# EAGLE design ab-berry (EAGLE 7.3.0)
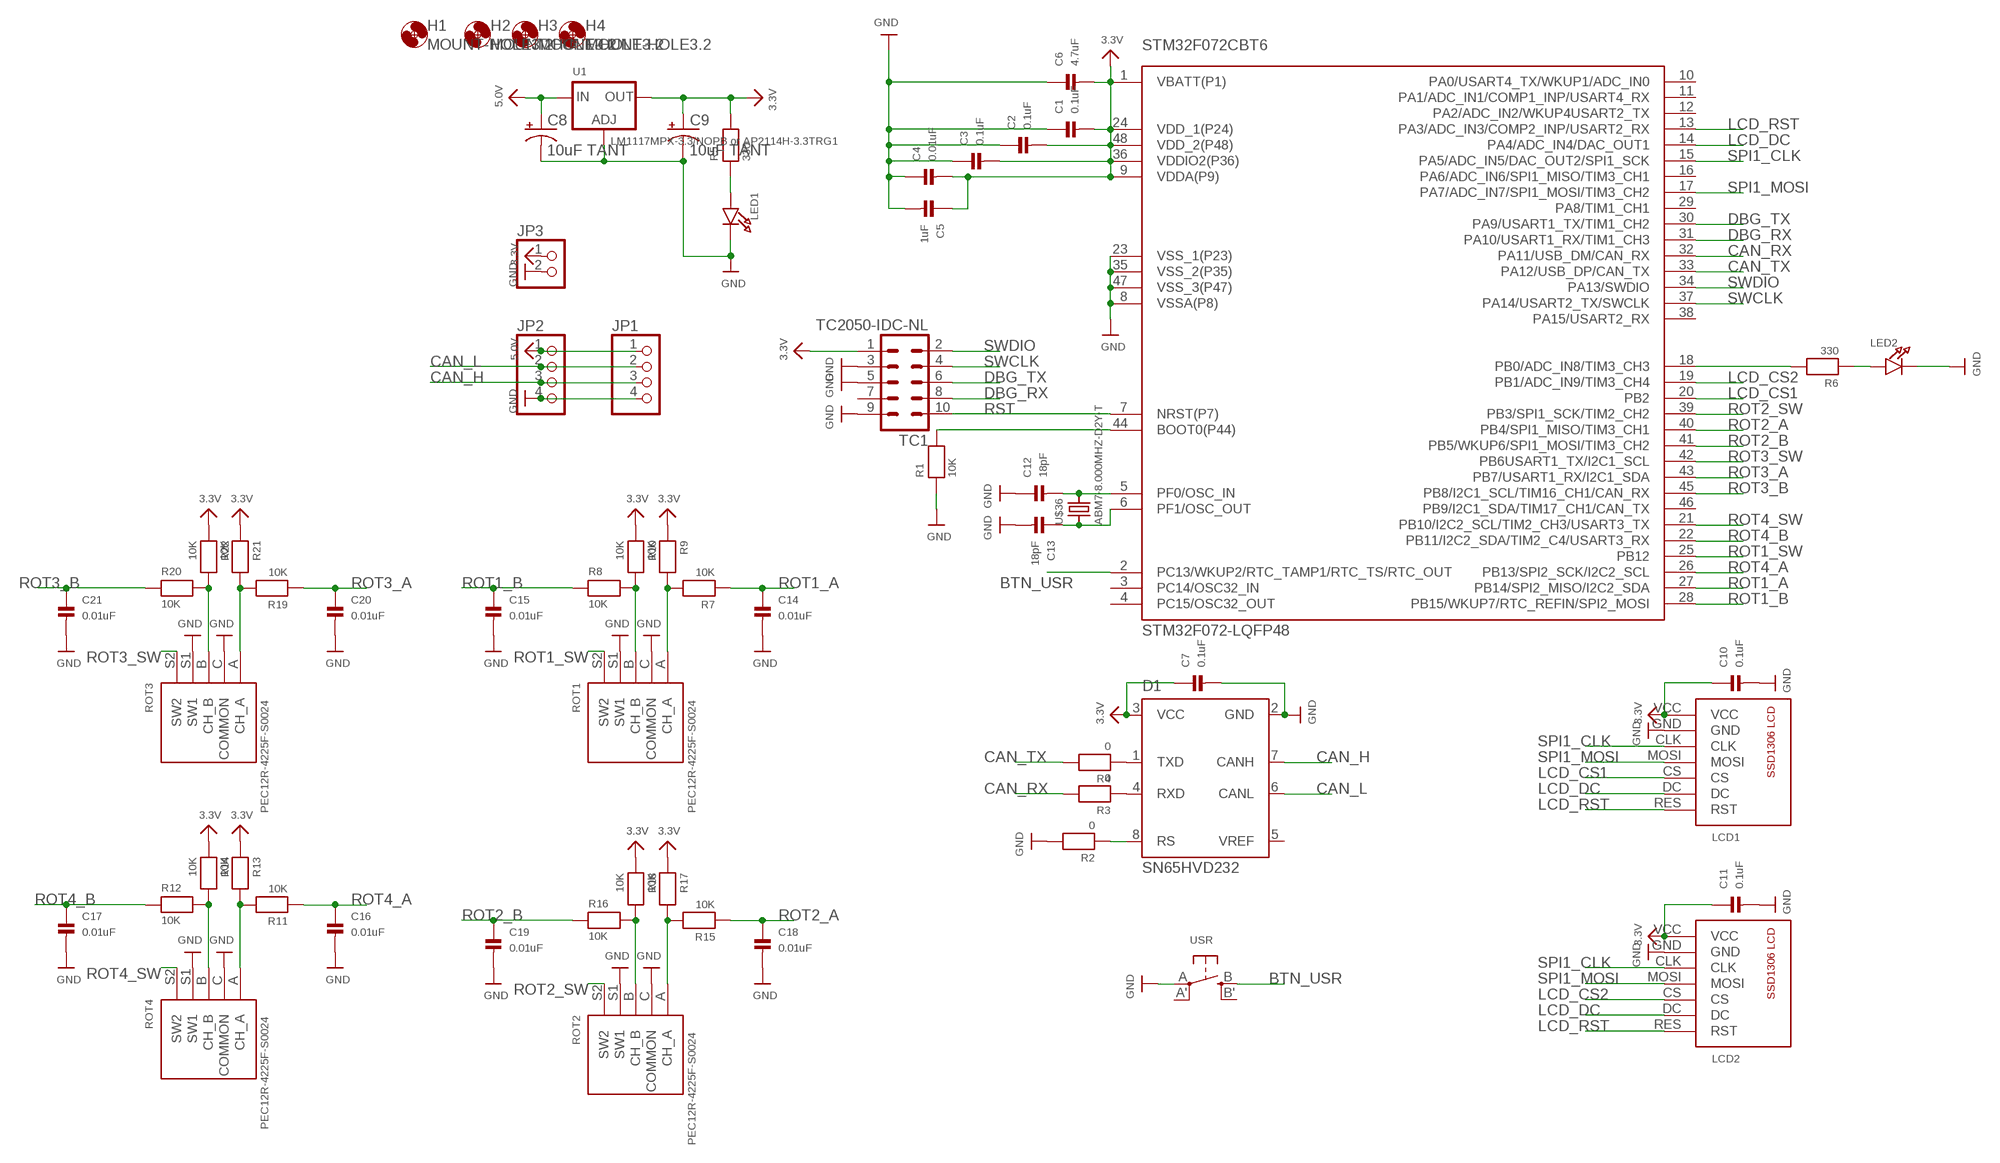
[diagram p0: schematic, sheet 1]

## Parts
C1  0.1uF  CAP_CERAMIC0603  [0603]
C2  0.1uF  CAP_CERAMIC0603  [0603]
C3  0.1uF  CAP_CERAMIC0603  [0603]
C4  0.01uF  CAP_CERAMIC0603  [0603]
C5  1uF  CAP_CERAMIC0603  [0603]
C6  4.7uF  CAP_CERAMIC0603  [0603]
C7  0.1uF  CAP_CERAMIC0603  [0603]
C8  10uF TANT  10UF-6.3V-20%(0603)(TANT)"  [0603-POL]
C9  10uF TANT  10UF-6.3V-20%(0603)(TANT)"  [0603-POL]
C10  0.1uF  CAP_CERAMIC0603  [0603]
C11  0.1uF  CAP_CERAMIC0603  [0603]
C12  18pF  CAP_CERAMIC0603  [0603]
C13  18pF  CAP_CERAMIC0603  [0603]
C14  0.01uF  CAP_CERAMIC0603  [0603]
C15  0.01uF  CAP_CERAMIC0603  [0603]
C16  0.01uF  CAP_CERAMIC0603  [0603]
C17  0.01uF  CAP_CERAMIC0603  [0603]
C18  0.01uF  CAP_CERAMIC0603  [0603]
C19  0.01uF  CAP_CERAMIC0603  [0603]
C20  0.01uF  CAP_CERAMIC0603  [0603]
C21  0.01uF  CAP_CERAMIC0603  [0603]
D1  SN65HVD232  SN65HVD230  [SO8]
H1  MOUNT-HOLE3.2  [3,2]
H2  MOUNT-HOLE3.2  [3,2]
H3  MOUNT-HOLE3.2  [3,2]
H4  MOUNT-HOLE3.2  [3,2]
JP1  PINHD-1X4  [1X04]
JP2  PINHD-1X4  [1X04]
JP3  PINHD-1X2  [1X02]
LCD1  SSD1306-7PIN  [SSD1306-7PIN]
LCD2  SSD1306-7PIN  [SSD1306-7PIN]
LED1  LED0603  [CHIPLED_0603]
LED2  LED0603  [CHIPLED_0603]
R1  10K  RESISTOR0603  [0603]
R2  0  RESISTOR0603  [0603]
R3  0  RESISTOR0603  [0603]
R4  0  RESISTOR0603  [0603]
R5  330  RESISTOR0603  [0603]
R6  330  RESISTOR0603  [0603]
R7  10K  RESISTOR0603  [0603]
R8  10K  RESISTOR0603  [0603]
R9  10K  RESISTOR0603  [0603]
R10  10K  RESISTOR0603  [0603]
R11  10K  RESISTOR0603  [0603]
R12  10K  RESISTOR0603  [0603]
R13  10K  RESISTOR0603  [0603]
R14  10K  RESISTOR0603  [0603]
R15  10K  RESISTOR0603  [0603]
R16  10K  RESISTOR0603  [0603]
R17  10K  RESISTOR0603  [0603]
R18  10K  RESISTOR0603  [0603]
R19  10K  RESISTOR0603  [0603]
R20  10K  RESISTOR0603  [0603]
R21  10K  RESISTOR0603  [0603]
R22  10K  RESISTOR0603  [0603]
ROT1  PEC12R-4225F-S0024  PEC11-4215K-S0024  [PEC111-4XXXK-SXXXX]
ROT2  PEC12R-4225F-S0024  PEC11-4215K-S0024  [PEC111-4XXXK-SXXXX]
ROT3  PEC12R-4225F-S0024  PEC11-4215K-S0024  [PEC111-4XXXK-SXXXX]
ROT4  PEC12R-4225F-S0024  PEC11-4215K-S0024  [PEC111-4XXXK-SXXXX]
STM32F072CBT6  STM32F072-LQFP48  [LQFP48]
TC1  TC2050-IDC-NL  [TC2050-IDC-NL]
U1  LM1117MPX-3.3/NOPB or AP2114H-3.3TRG1  LM1117SOT223-REFLOW  [SOT223-R]
U$36  ABM7-8.000MHZ-D2Y-T  [ABM7-8.000MHZ-D2Y-T]
USR  SWITCH_TACT_SMT  [EVQ-Q2]

## Nets
3.3V: C1.2 C2.2 C3.2 C4.2 C5.1 C6.2 C7.1 C9.A(+) C10.1 C11.1 D1.3(VCC) JP3.1 LCD1.VCC LCD2.VCC R5.2 R9.1 R10.1 R13.1 R14.1 R17.1 R18.1 R21.1 R22.1 STM32F072CBT6.1(VBATT(P1)) STM32F072CBT6.9(VDDA(P9)) STM32F072CBT6.24(VDD_1(P24)) STM32F072CBT6.36(VDDIO2(P36)) STM32F072CBT6.48(VDD_2(P48)) TC1.1 U1.2(OUT)
5.0V: C8.A(+) JP1.1 JP2.1 U1.3(IN)
BTN_USR: STM32F072CBT6.2(PC13/WKUP2/RTC_TAMP1/RTC_TS/RTC_OUT) USR.B(S)
CAN_H: D1.7(CANH) JP1.3 JP2.3
CAN_L: D1.6(CANL) JP1.2 JP2.2
CAN_RX: R3.2 STM32F072CBT6.32(PA11/USB_DM/CAN_RX)
CAN_TX: R4.2 STM32F072CBT6.33(PA12/USB_DP/CAN_TX)
DBG_RX: STM32F072CBT6.31(PA10/USART1_RX/TIM1_CH3) TC1.8
DBG_TX: STM32F072CBT6.30(PA9/USART1_TX/TIM1_CH2) TC1.6
GND: C1.1 C2.1 C3.1 C4.1 C5.2 C6.1 C7.2 C8.K(-) C9.K(-) C10.2 C11.2 C12.1 C13.2 C14.2 C15.2 C16.2 C17.2 C18.2 C19.2 C20.2 C21.2 D1.2(GND) JP1.4 JP2.4 JP3.2 LCD1.GND LCD2.GND LED1.C LED2.C R1.1 R2.2 ROT1.C(COMMON) ROT1.S1(SW1) ROT2.C(COMMON) ROT2.S1(SW1) ROT3.C(COMMON) ROT3.S1(SW1) ROT4.C(COMMON) ROT4.S1(SW1) STM32F072CBT6.8(VSSA(P8)) STM32F072CBT6.23(VSS_1(P23)) STM32F072CBT6.35(VSS_2(P35)) STM32F072CBT6.47(VSS_3(P47)) TC1.3 TC1.5 TC1.9 U1.1(ADJ) USR.A(P)
LCD_CS1: LCD1.CS STM32F072CBT6.20(PB2)
LCD_CS2: LCD2.CS STM32F072CBT6.19(PB1/ADC_IN9/TIM3_CH4)
LCD_DC: LCD1.DC LCD2.DC STM32F072CBT6.14(PA4/ADC_IN4/DAC_OUT1)
LCD_RST: LCD1.RES(RST) LCD2.RES(RST) STM32F072CBT6.13(PA3/ADC_IN3/COMP2_INP/USART2_RX)
N$1: R1.2 STM32F072CBT6.44(BOOT0(P44))
N$2: D1.8(RS) R2.1
N$3: LED1.A R5.1
N$4: D1.4(RXD) R3.1
N$5: D1.1(TXD) R4.1
N$6: R6.2 STM32F072CBT6.18(PB0/ADC_IN8/TIM3_CH3)
N$7: LED2.A R6.1
N$8: C12.2 STM32F072CBT6.5(PF0/OSC_IN) U$36.P$2
N$9: C13.1 STM32F072CBT6.6(PF1/OSC_OUT) U$36.P$1
N$10: R8.2 R10.2 ROT1.B(CH_B)
N$11: R7.2 R9.2 ROT1.A(CH_A)
N$12: R12.2 R14.2 ROT4.B(CH_B)
N$13: R11.2 R13.2 ROT4.A(CH_A)
N$14: R16.2 R18.2 ROT2.B(CH_B)
N$15: R15.2 R17.2 ROT2.A(CH_A)
N$16: R20.2 R22.2 ROT3.B(CH_B)
N$17: R19.2 R21.2 ROT3.A(CH_A)
ROT1_A: C14.1 R7.1 STM32F072CBT6.27(PB14/SPI2_MISO/I2C2_SDA)
ROT1_B: C15.1 R8.1 STM32F072CBT6.28(PB15/WKUP7/RTC_REFIN/SPI2_MOSI)
ROT1_SW: ROT1.S2(SW2) STM32F072CBT6.25(PB12)
ROT2_A: C18.1 R15.1 STM32F072CBT6.40(PB4/SPI1_MISO/TIM3_CH1)
ROT2_B: C19.1 R16.1 STM32F072CBT6.41(PB5/WKUP6/SPI1_MOSI/TIM3_CH2)
ROT2_SW: ROT2.S2(SW2) STM32F072CBT6.39(PB3/SPI1_SCK/TIM2_CH2)
ROT3_A: C20.1 R19.1 STM32F072CBT6.43(PB7/USART1_RX/I2C1_SDA)
ROT3_B: C21.1 R20.1 STM32F072CBT6.45(PB8/I2C1_SCL/TIM16_CH1/CAN_RX)
ROT3_SW: ROT3.S2(SW2) STM32F072CBT6.42(PB6USART1_TX/I2C1_SCL)
ROT4_A: C16.1 R11.1 STM32F072CBT6.26(PB13/SPI2_SCK/I2C2_SCL)
ROT4_B: C17.1 R12.1 STM32F072CBT6.22(PB11/I2C2_SDA/TIM2_C4/USART3_RX)
ROT4_SW: ROT4.S2(SW2) STM32F072CBT6.21(PB10/I2C2_SCL/TIM2_CH3/USART3_TX)
RST: STM32F072CBT6.7(NRST(P7)) TC1.10
SPI1_CLK: LCD1.CLK LCD2.CLK STM32F072CBT6.15(PA5/ADC_IN5/DAC_OUT2/SPI1_SCK)
SPI1_MOSI: LCD1.MOSI LCD2.MOSI STM32F072CBT6.17(PA7/ADC_IN7/SPI1_MOSI/TIM3_CH2)
SWCLK: STM32F072CBT6.37(PA14/USART2_TX/SWCLK) TC1.4
SWDIO: STM32F072CBT6.34(PA13/SWDIO) TC1.2
Unconnected: D1.5(VREF) STM32F072CBT6.3(PC14/OSC32_IN) STM32F072CBT6.4(PC15/OSC32_OUT) STM32F072CBT6.10(PA0/USART4_TX/WKUP1/ADC_IN0) STM32F072CBT6.11(PA1/ADC_IN1/COMP1_INP/USART4_RX) STM32F072CBT6.12(PA2/ADC_IN2/WKUP4USART2_TX) STM32F072CBT6.16(PA6/ADC_IN6/SPI1_MISO/TIM3_CH1) STM32F072CBT6.29(PA8/TIM1_CH1) STM32F072CBT6.38(PA15/USART2_RX) STM32F072CBT6.46(PB9/I2C1_SDA/TIM17_CH1/CAN_TX) TC1.7 USR.A'(P1) USR.B'(S1)

## Library data of the parts
C1-C7 C10-C21 = microbuilder:CAP_CERAMIC: Ceramic Capacitors 0402 - 0402 Surface Mount Capacitors 16pF 50V 5% [Digikey: 445-4899-2-ND] 18pF 50V 5% [Digikey: 490-1281-2-ND] 22pF 50V 5% [Digikey: 490-1283-2-ND] 68pF 50V 5% [Digikey: 490-1289-2-ND] 0.1uF 10V 10% [Digikey: 490-1318-2-ND] 1.0uF 6.3V 10% [Digikey: 490-1320-2-ND] 0603 - 0603 Surface Mount Capacitors 16 pF 50V 5% [Digikey: 445-5051-2-ND] 22 pF 50V [Digikey: PCC220ACVTR-ND] 33 pF 50V 5% [Digikey: 490-1415-1-ND] 56pF 50V 5% [Digikey: 490-1421-1-ND] 220pF 50V 5% [Digikey: 445-1285-1-ND] 680 pF 50V 2200 pF 50V 5% C0G [Digikey: 445-1297-1-ND] 5600 pF 100V 5% X7R [Digikey: 478-3711-1-ND] 0.1 µF 25V 10% [Digikey: PCC2277TR-ND] 0.22 µF 16V 10% X7R [Digikey: 445-1318-1-ND] 1.0 µF 25V 10% [Digikey: 445-5146-2-ND] 0603 - RF Specific 3pF 250V +/-0.1pF RF [Digikey: 712-1347-1-ND] 18 pF 250V 5% [Digikey: 478-3505-1-ND or 712-1322-1-ND] 56 pF 250V 5% C0G RF [Digikey: 490-4867-1-ND] 68 pF 250V RF [Digikey: 490-4868-1-ND] 0805 - 0805 Surface Mount Capacitors 220 pF 250V 2% RF Ceramic Capacitor [Digikey: 712-1398-1-ND] 1000 pF 50V 2% NP0 Ceramic Capacitor [Digikey: 478-3760-1-ND] 0.1 µF 25V 10% Ceramic Capacitor [Digikey: PCC1828TR-ND] 1.0 µF 16V 10% Ceramic Capacitor[Digikey: 490-1691-2-ND] 10.0 µF 10V 10% Ceramic Capacitor[Digikey: 709-1228-1-ND] 10.0 uF 16V 10% Ceramic Capacitor [Digikey: 478-5165-2-ND] 47 uF 6.3V 20% Ceramic Capacitor [Digikey: 587-1779-1-ND or 399-5506-1-ND] 1206 - 1206 Surface Mount Capacitors 47uF 10V 20% Ceramic Capacitor [Digikey: 490-5528-1-ND or 399-5508-1-ND or 445-6010-1-ND] 100uF 6.3V -20%, +80% Y5V Ceramic Capacitor (Digikey: 490-4512-1-ND, Mouser: 81-GRM31CF50J107ZE1L)
C8 C9 = SparkFun-Capacitors:10UF-6.3V-20%(0603)(TANT); PROD_ID: CAP-13210; VALUE: 10uF
D1 = omc:SN65HVD230: SN65HVD230 - 3.3V CAN Transceiver - 3.3V operation - ISO 11898 compliant - up to 1Mbps - up to 120 nodes - listen only mode - slope control
H1-H4 = holes:MOUNT-HOLE: MOUNTING HOLE with drill center marker
JP1 JP2 = keves:PINHD-1X4: PIN HEADER
JP3 = pinhead:PINHD-1X2: PIN HEADER
LCD1 LCD2 = keves:SSD1306-7PIN: https://www.aliexpress.com/item/free-shipping-0-96-inch-OLED-display-module-128X64-OLED-For-arduino-I2C-IIC-SPI-7p/32595065668.html?ws_ab_test=searchweb0_0,searchweb201602_1_116_117_10065_10068_114_10067_115_10069_113_10017_10080_10082_10081_10060_10061_10062_10056_10055_10054_10059_10078_10079_10073_10070_10052_10053_10050_10051,searchweb201603_6&btsid=51ed1bae-6cee-4f36-9ddd-1a85c2e0ff68
LED1 LED2 = microbuilder:LED: LED 0603 - 0603 Surface Mount Package 2mA: Green LED - Low Power (3.9mcd, 2ma, 1.7Vf) - Digikey: 475-2709-2-ND Orange LED - Low Power (9.8mcd, 2ma, 1.8Vf) - Digikey: 475-1194-2-ND Red LED - Low Power (5mcd, 2ma, 1.8Vf) - Digikey: 475-1195-2-ND Yellow LED - Low Power (7mcd, 2ma, 1.8Vf) - Digikey: 475-1196-2-ND 5mA: Blue LED - Low Power (17mcd, 5ma, 2.9Vf) - Digikey: LNJ937W8CRACT-ND 0805 - 0805 Surface Mount Package 2mA: Red LED (8.8mcd, 2mA, 1.8Vf, Clear) - Low Power [Digikey: 475-2510-1-ND] Green LED (5mcd, 2mA, 1.8Vf, Clear) - Low Power [Digikey: 475-2730-1-ND] Yellow LED (11.3mcd, 2mA, 1.8Vf, Clear) - Low Power [Digikey: 475-2555-1-ND] 20mA: Red LED (104mcd, 20mA, Diffused) - LS R976 [Digikey: 475-1278-6-ND] Red LED (12mcd, 20mA, 2.0Vf, Clear) - APT2012EC [Digikey: 754-1128-1-ND] Green LED (15mcd, 20mA, 2.2Vf, Clear) - APT2012GC [Digikey: 754-1131-1-ND] Orange LED (160mcd, 20mA, 2.1Vf, Clear) - APT2012SECK [Digikey: 754-1130-1-ND] 1206 - 1206 Surface Mount Package Green LED (26mcd, 20mA, Diffused) - LG N971 [Digikey: 475-1407-6-ND] Red LED (15mcd, 20mA, Diffused) - LH N974 [Digikey: 475-1416-6-ND]
R1-R22 = microbuilder:RESISTOR: Resistors 0402 - 0402 Surface Mount Package 22 Ohm 1% 1/16W [Digikey: 311-22.0LRTR-ND] 33 Ohm 5% 1/16W 1.0K 5% 1/16W 1.5K 5% 1/16W 2.0K 1% 1/16W 10.0K 1% 1/16W [Digikey: 311-10.0KLRTR-ND] 10.0K 5% 1/16W [Digikey: RMCF0402JT10K0TR-ND] 12.1K 1% 1/16W [Digikey: 311-22.0LRTR-ND] 100.0K 5% 1/16W 0603 - 0603 Surface Mount Package 0 Ohm 1/10 Watt 1% Resistor 15 Ohm 1/10 Watt 1% Resistor 33 Ohm 1/10 Watt 1% Resistor 49.9 Ohm 1/10 Watt 1% Resistor 100 Ohm 1/10 Watt 1% Resistor 150 Ohm 1/10 Watt 1% Resistor 240 Ohm 1/10 Watt 1% Resistor 390 Ohm 1/10 Watt 1% Resistor 560 Ohm 1/10 Watt 1% Resistor 680 Ohm 1/10 Watt 1% Resistor 750 Ohm 1/10 Watt 1% Resistor 1.0K Ohm 1/10 Watt 1% Resistor 1.5K Ohm 1/10 Watt 1% Resistor 2.0K Ohm 1/10 Watt 1% Resistor 2.2K Ohm 1/10 Watt 1% Resistor 3.3K Ohm 1/10 Watt 1% Resistor 4.7K Ohm 1/10 Watt 1% Resistor 10.0K Ohm 1/10 Watt 1% Resistor 12.0K Ohm 1/10 Watt 1% Resistor 12.1K Ohm 1/10 Watt 1% Resistor 20.0K Ohm 1/10 Watt 1% Resistor 33.0K Ohm 1/10 Watt 1% Resistor 100.0K Ohm 1/10 Watt 1% Resistor 0805 - 0805 Surface Mount Package 0 Ohm 1/8 Watt 1% Resistor 33 Ohm 1/8 Watt 1% Resistor 100 Ohm 1/8 Watt 1% Resistor 150 Ohm 1/8 Watt 1% Resistor 200 Ohm 1/8 Watt 1% Resistor 240 Ohm 1/8 Watt 1% Resistor 330 Ohm 1/8 Watt 1% Resistor 390 Ohm 1/8 Watt 1% Resistor 470 Ohm 1/8 Watt 1% Resistor 1.0K Ohm 1/8 Watt 1% Resistor 1.5K Ohm 1/8 Watt 1% Resistor 2.0K Ohm 1/8 Watt 1% Resistor 4.7K Ohm 1/8 Watt 1% Resistor 5.1K Ohm 1/8 Watt 1% Resistor 5.6K Ohm 1/8 Watt 1% Resistor 10.0K Ohm 1/8 Watt 1% Resistor 22.0K Ohm 1/8 Watt 1% Resistor 33.0K Ohm 1/8 Watt 1% Resistor 100K Ohm 1/8 Watt 1% Resistor 1206 - 1206 Surface Mount Package 2012 - 2010 Surface Mount Package 0.11 Ohm 1/2 Watt 1% Resistor - Digikey: RHM.11UCT-ND
ROT1-ROT4 = keves:PEC11-4215K-S0024
STM32F072CBT6 = stm32f0:STM32F072
TC1 = TagConnect:TC2050-IDC: Tag-Connect In Circuit Programming & Debug Cable 10 Pin http://www.tag-connect.com
U1 = microbuilder:LM1117: LM1117 Voltage Regulator LM1117 Adjustable Voltage regulator [Digikey: LM1117IMP-ADJDKR-ND] LM1117 3.3V Voltage regulator [AP1117E33GDIDKR-ND] LM1117 5.0V Voltage regulator [AP1117E50GDIDKR-ND] SOT223-REFLOW - SOT223 package for solder paste/reflow ovens SOT223-WAVE - SOT223 package for hand-soldering (larger pads) Note: For the fixed-voltage regulators, simply set the ADJ pin to GND.
U$36 = keves:ABM7-8.000MHZ-D2Y-T
USR = microbuilder:SWITCH_TACT_SMT: SMT Tact Switches 6x6mm - Digikey: P12940SCT-ND KMR2 (4.6x2.8mm) - Digikey: 401-1426-1-ND EVQ-PQHB55 - Light Touch, 160GF (4.5x4.5mm) - Digikey: P8090SCT-ND

## Board
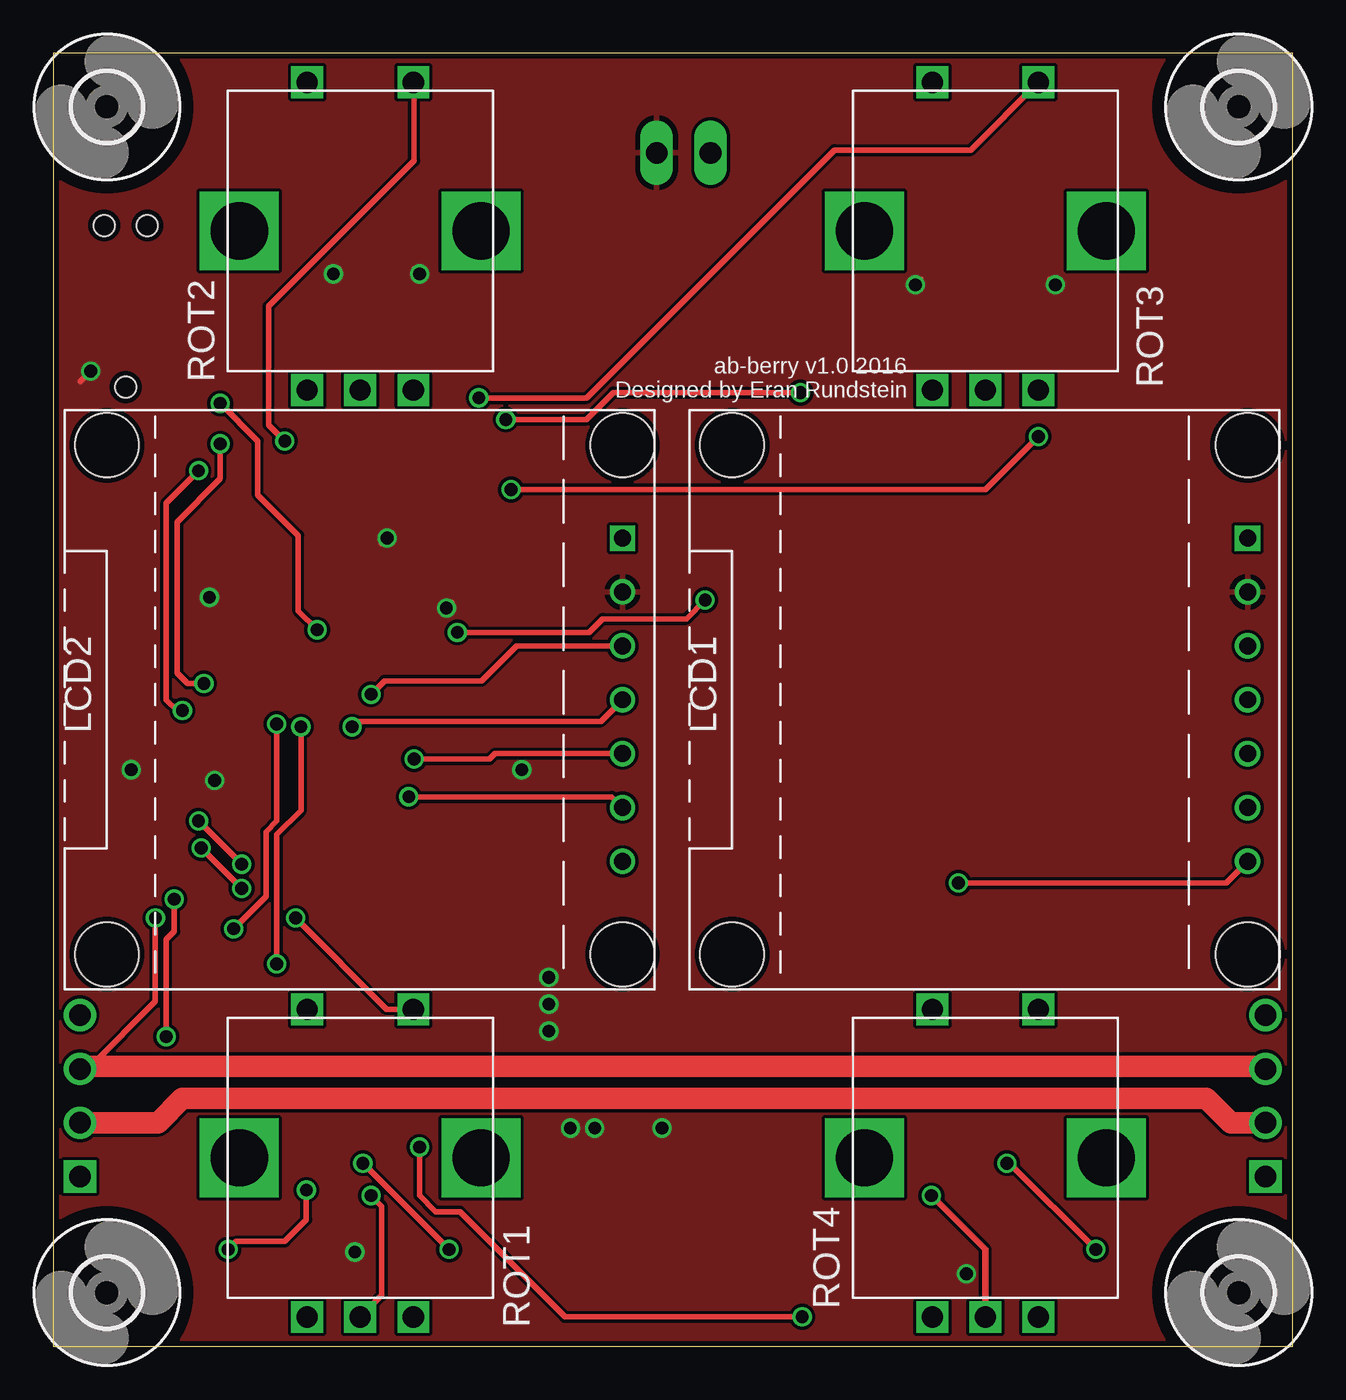
[diagram p1: board, top side]
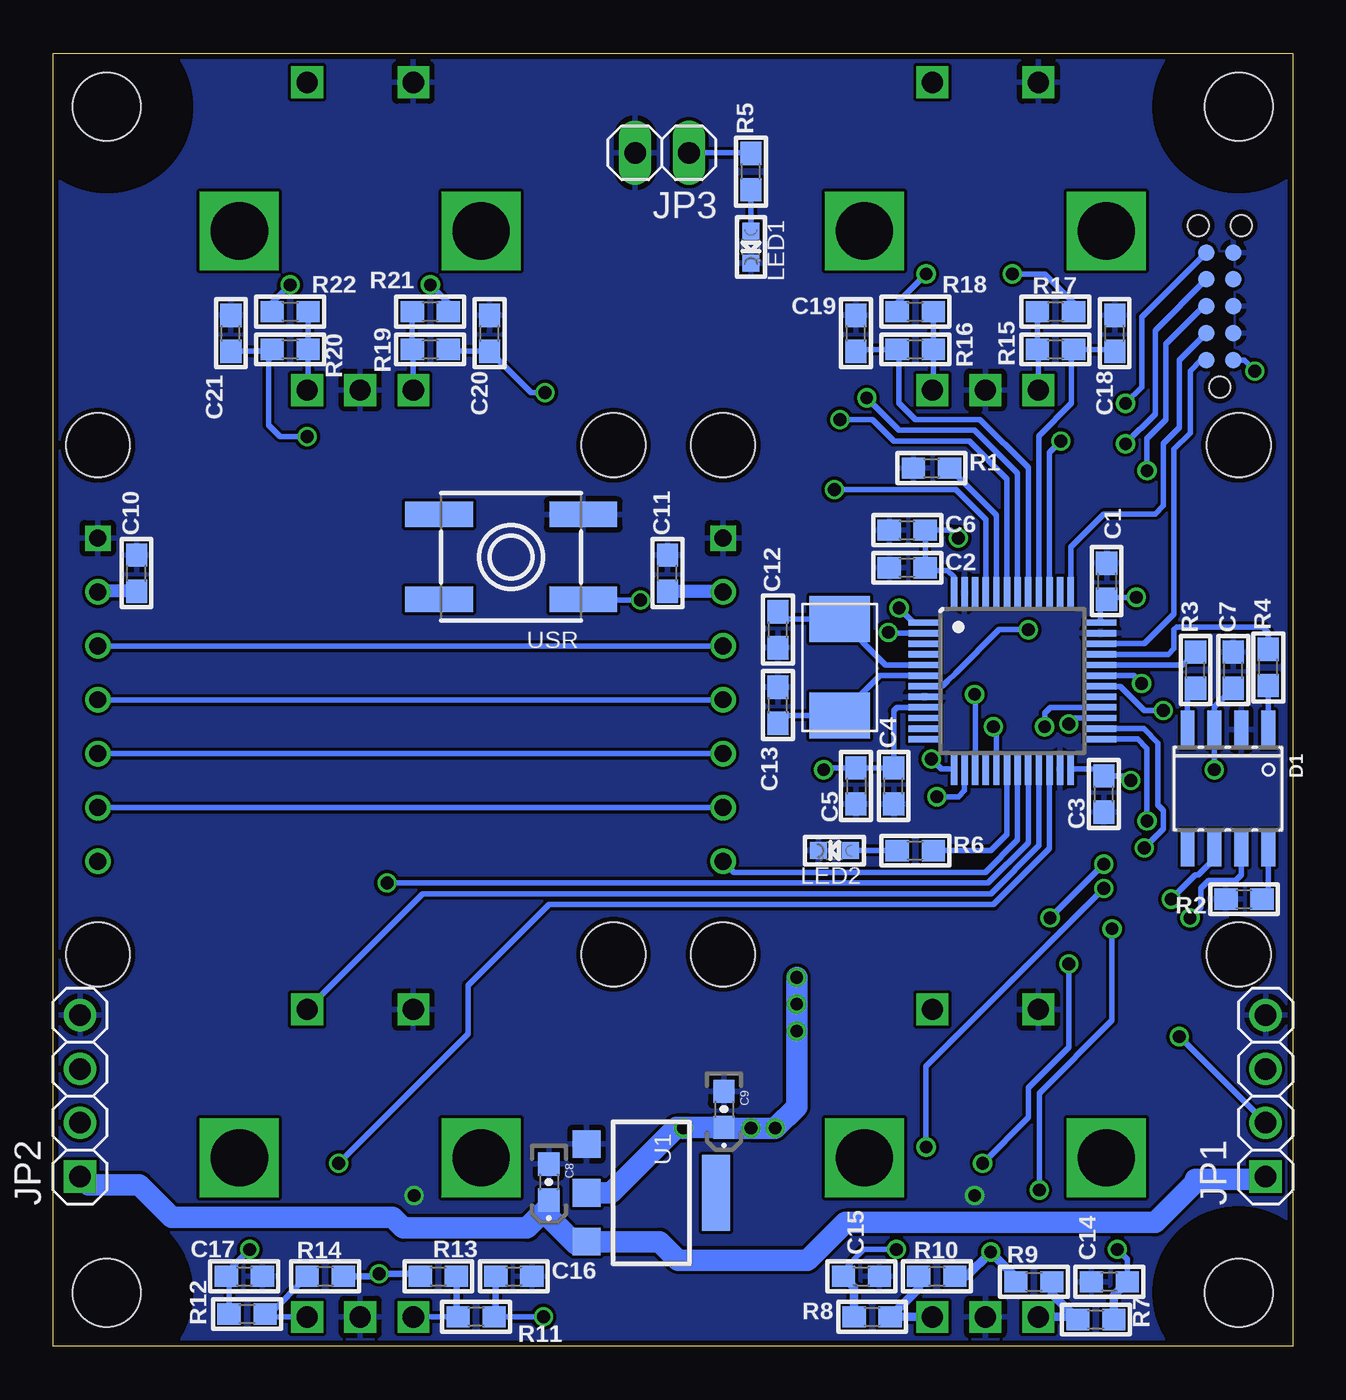
[diagram p2: board, bottom side, seen from below]

Size 58.42 x 60.96 mm. Coordinates in mm from the lower left corner, seen from the top.
Outline: 0,0 58.42,0 58.42,60.96 0,60.96 0,0
Copper layers (1*16): Top 0.035mm / dielectric 1.5mm / Bottom 0.035mm
Design rules "MacroFab_Standard_2_Layer *": minimum track width 6mil, minimum drill 12mil, track to track 6mil, track to pad 6mil, pad to pad 6mil, via to via 6mil, smd to smd 0mil, copper to edge 10mil, drill to drill 10mil, minimum pad ring 6mil, minimum via ring 6mil, stop-mask expansion 2mil, vias tented up to drill 25mil, thermal gap 10mil

### Footprints (pad centres in the part's own frame; a part is rotated, then mirrored left to right if it is on the bottom)
0603 = smd 1.1 x 1: 1 -0.85,0; 2 0.85,0
0603-POL = smd 1.1 x 1: A 0.85,0; K -0.85,0
SO8 = smd 0.65 x 1.75: 1 -1.905,-2.8; 2 -0.635,-2.8; 3 0.635,-2.8; 4 1.905,-2.8; 5 1.905,2.8; 6 0.635,2.8; 7 -0.635,2.8; 8 -1.905,2.8
3,2 = hole 3.2: 0,0
1X04 = drill 1.016 square: 1 -3.81,0 | drill 1.016: 2 -1.27,0; 3 1.27,0; 4 3.81,0
1X02 = drill 1.016 long: 1 -1.27,0; 2 1.27,0
SSD1306-7PIN = drill 0.8: CLK -2.54,24.3; CS 7.62,24.3; DC 5.08,24.3; MOSI 0,24.3; RES 2.54,24.3; VCC -5.08,24.3 | drill 0.8 square: GND -7.62,24.3 | hole 3: -12,24.3; 12,24.3; -12,0; 12,0
CHIPLED_0603 = smd 0.8 x 0.8: A 0,-0.75; C 0,0.75
PEC111-4XXXK-SXXXX = drill 1 square: A -2.5,-7.5; B 2.5,-7.5; C 0,-7.5; S1 -2.5,7; S2 2.5,7 | drill 2.7 square: P$1 -5.7,0; P$2 5.7,0
LQFP48 = smd 1.5 x 0.3: 1 -4.15,2.75; 2 -4.15,2.25; 3 -4.15,1.75; 4 -4.15,1.25; 5 -4.15,0.75; 6 -4.15,0.25; 7 -4.15,-0.25; 8 -4.15,-0.75; 9 -4.15,-1.25; 10 -4.15,-1.75; 11 -4.15,-2.25; 12 -4.15,-2.75; 25 4.15,-2.75; 26 4.15,-2.25; 27 4.15,-1.75; 28 4.15,-1.25; 29 4.15,-0.75; 30 4.15,-0.25; 31 4.15,0.25; 32 4.15,0.75; 33 4.15,1.25; 34 4.15,1.75; 35 4.15,2.25; 36 4.15,2.75 | smd 0.3 x 1.5: 13 -2.75,-4.15; 14 -2.25,-4.15; 15 -1.75,-4.15; 16 -1.25,-4.15; 17 -0.75,-4.15; 18 -0.25,-4.15; 19 0.25,-4.15; 20 0.75,-4.15; 21 1.25,-4.15; 22 1.75,-4.15; 23 2.25,-4.15; 24 2.75,-4.15; 37 2.75,4.15; 38 2.25,4.15; 39 1.75,4.15; 40 1.25,4.15; 41 0.75,4.15; 42 0.25,4.15; 43 -0.25,4.15; 44 -0.75,4.15; 45 -1.25,4.15; 46 -1.75,4.15; 47 -2.25,4.15; 48 -2.75,4.15
TC2050-IDC-NL = smd 0.787 x 0.787: 1 -2.54,-0.635; 2 -2.54,0.635; 3 -1.27,-0.635; 4 -1.27,0.635; 5 0,-0.635; 6 0,0.635; 7 1.27,-0.635; 8 1.27,0.635; 9 2.54,-0.635; 10 2.54,0.635 | hole 0.991: -3.81,0; 3.81,1.016; 3.81,-1.016
SOT223-R = smd 1.3 x 1.3: 1 -2.3,-3.05; 2 0,-3.05; 3 2.3,-3.05 | smd 3.6 x 1.3: 4 0,3.05
ABM7-8.000MHZ-D2Y-T = smd 2.159 x 2.845: P$1 -2.273,0; P$2 2.273,0
EVQ-Q2 = smd 3.2 x 1.2: A -3.4,-2; A' 3.4,-2; B -3.4,2; B' 3.4,2

### Placement (x,y rotation side)
C1  8.76,36.07 270 bottom
C2  18.16,36.7 0 bottom
C3  8.89,26.04 90 bottom
C4  18.8,26.42 90 bottom
C5  20.57,26.42 270 bottom
C6  18.16,38.48 0 bottom
C7  2.79,31.88 90 bottom
C8  35.05,7.75 270 bottom
C9  26.8,11.18 270 bottom
C10  54.48,36.45 90 bottom
C11  29.46,36.45 90 bottom
C12  24.26,33.78 90 bottom
C13  24.26,30.23 90 bottom
C14  8.64,3.05 180 bottom
C15  20.32,3.3 0 bottom
C16  36.7,3.3 0 bottom
C17  49.4,3.3 0 bottom
C18  8.38,47.75 90 bottom
C19  20.57,47.75 90 bottom
C20  37.85,47.75 90 bottom
C21  50.04,47.75 90 bottom
D1  3.05,26.29 180 bottom
H1  2.54,58.42 0 top
H2  2.54,2.54 0 top
H3  55.88,58.42 0 top
H4  55.88,2.54 0 top
JP1  1.27,11.81 90 bottom
JP2  57.15,11.81 90 bottom
JP3  29.72,56.26 180 bottom
LCD1  32,30.48 270 top
LCD2  2.54,30.48 270 top
LED1  25.53,51.82 180 bottom
LED2  21.59,23.37 90 bottom
R1  17.02,41.4 0 bottom
R2  2.29,21.08 180 bottom
R3  4.57,31.88 90 bottom
R4  1.14,32 90 bottom
R5  25.53,55.37 90 bottom
R6  17.78,23.37 0 bottom
R7  9.27,1.27 180 bottom
R8  19.81,1.4 0 bottom
R9  12.19,3.05 0 bottom
R10  16.76,3.3 180 bottom
R11  38.48,1.4 180 bottom
R12  49.28,1.52 0 bottom
R13  40.26,3.3 0 bottom
R14  45.59,3.3 180 bottom
R15  11.18,46.99 180 bottom
R16  17.78,46.99 0 bottom
R17  11.18,48.77 180 bottom
R18  17.78,48.77 0 bottom
R19  40.64,46.99 180 bottom
R20  47.24,46.99 0 bottom
R21  40.64,48.77 180 bottom
R22  47.24,48.77 0 bottom
ROT1  14.48,8.89 0 top
ROT2  14.48,52.58 0 top
ROT3  43.94,52.58 0 top
ROT4  43.94,8.89 0 top
STM32F072CBT6  13.21,31.37 0 bottom
TC1  3.43,49.02 90 bottom
U1  30.23,7.24 270 bottom
U$36  21.34,32 90 bottom
USR  36.83,37.21 180 bottom

### Tracks (layer width: path | path; a pad name or v marks a point on that pad's centre or on a via)
3.3V  (via drill 0.6)
  Top 0.254: v1.78,45.97 1.27,45.47 | v22.1,27.18 22.35,26.92 | v18.54,34.8 18.8,35.05 | v15.75,38.1 15.49,37.85 | v7.62,26.67 7.49,26.67 7.37,26.54 | v17.27,50.55 17.02,50.8 | v13.21,50.55 13.46,50.8 | v40.64,50.04 40.89,50.29 | v47.24,50.04 46.99,50.29
  Top 0.406: v14.22,4.45 14.35,4.57
  Bottom 0.254: JP3.1 25.57,56.26 R5.2 | TC1.1 2.29,46.48 v1.78,45.97 | STM32F072CBT6.9 18.65,30.12 18.8,29.97 C4.2 C5.1 22.01,27.27 v22.1,27.18 | STM32F072CBT6.1 17.86,34.12 v18.54,34.8 | v15.75,38.1 16.13,38.48 C6.2 C2.2 17.18,36.58 16.26,36.58 15.96,36.28 STM32F072CBT6.48 | v3.68,27.18 D1.3 3.68,30.14 C7.1 | v7.37,35.31 8.68,35.31 C1.2 9.06,34.92 STM32F072CBT6.36 | STM32F072CBT6.24 9.22,27.22 C3.2 7.83,26.89 v7.62,26.67 | R14.1 44.74,3.52 | R18.1 18.63,49.19 v17.27,50.55 | R17.1 10.33,49.19 11.68,50.55 v13.21,50.55 | R21.1 39.79,49.19 v40.64,50.04 | R22.1 48.09,49.19 v47.24,50.04
  Bottom 0.305: R13.1 41.24,3.43 v43.05,3.43 43.18,3.3 R14.1
  Bottom 0.406: R9.1 13.04,3.26 v14.22,4.45 15.37,3.3 R10.1
  Bottom 0.61: C11.1 26.8,35.6 LCD2.VCC | C10.1 56.27,35.6 LCD1.VCC
  Bottom 1.016: 28.45,10.33 29.04,10.33 32.13,7.24 U1.2 | v28.7,10.29 28.49,10.29 28.45,10.33 | v25.53,10.29 v24.38,10.29 | 28.45,10.33 C9.A 26.8,10.29 v24.38,10.29 | v23.37,17.4 v23.37,14.86 23.37,11.3 v24.38,10.29
  other vias: 23.37,16.13
  pour Top: -1.78,-3.94 67.94,-3.94 67.94,66.17 -4.95,66.17 -4.95,64.26 -1.91,64.26 -1.91,-3.81
5.0V
  Bottom 1.016: JP1.1 1.4,7.87 4.57,7.87 4.57,7.75 6.48,5.84 21.08,5.84 22.86,4.06 28.96,4.06 29.83,4.94 U1.3 33.39,4.83 33.78,4.83 35.05,6.1 35.05,6.6 | 35.05,6.6 36.07,5.59 41.91,5.59 42.42,6.1 52.83,6.1 54.36,7.62 56.77,7.62 JP2.1 | 35.05,6.6 C8.A
BTN_USR  (via drill 0.6)
  Top 0.254: v30.73,35.18 29.84,34.29 25.91,34.29 25.27,33.66 v19.05,33.66
  Bottom 0.254: STM32F072CBT6.2 19.01,33.62 v19.05,33.66 | v30.73,35.18 33.4,35.18 USR.B
CAN_H  (via drill 0.6)
  Top 0.254: v4.83,20.19 4.83,16.26 1.78,13.21
  Top 1.016: JP2.3 57.02,13.08 56.9,13.21 1.78,13.21 1.4,13.21 JP1.3
  Bottom 0.254: D1.7 2.41,22.23 2.67,21.97 3.94,21.97 4.32,21.59 4.32,20.7 v4.83,20.19
CAN_L  (via drill 0.6)
  Top 0.254: v5.33,14.61 5.33,19.18 5.71,19.56 v5.71,21.08
  Top 1.016: JP1.2 4.95,10.54 6.1,11.68 54.36,11.68 55.5,10.54 JP2.2
  Bottom 0.254: v5.33,14.61 JP1.2 | 3.68,23.75 D1.6 3.68,22.99 4.45,22.23 4.57,22.23 v5.71,21.08
CAN_RX
  Bottom 0.254: STM32F072CBT6.32 5.18,32.12 R3.2
CAN_TX
  Bottom 0.254: STM32F072CBT6.33 5.86,32.62 5.59,32.89 5.59,33.78 5.46,33.91 1.4,33.91 1.14,33.66 R4.2
DBG_RX  (via drill 0.6)
  Top 0.254: v7.11,31.24 6.35,31.24 5.84,31.75 5.84,38.86 7.87,40.89 v7.87,42.55
  Bottom 0.254: STM32F072CBT6.31 7.49,31.62 v7.11,31.24 | TC1.8 6.48,47.88 6.48,43.94 v7.87,42.55
DBG_TX  (via drill 0.6)
  Top 0.254: v6.1,29.97 5.84,29.97 5.33,30.48 5.33,39.75 v6.86,41.27
  Bottom 0.254: TC1.6 4.19,49.02 5.97,47.24 5.97,43.69 6.86,42.8 v6.86,41.27 | v6.1,29.97 6.99,29.97 8.13,31.11 STM32F072CBT6.30
GND  (via drill 0.6)
  Top 0.254: v14.99,7.11 15.49,6.6 15.49,2.41 ROT1.C
  Top 0.305: ROT4.C 43.94,4.57 v41.4,7.11
  pour Bottom: -2.54,-2.92 67.18,-2.92 67.18,67.18 -5.71,67.18 -5.71,65.28 -2.67,65.28 -2.67,-2.79
LCD_CS1  (via drill 0.6)
  Top 0.254: v42.67,21.84 55.29,21.84 LCD1.CS
  Bottom 0.254: v42.67,21.84 14.35,21.84 12.46,23.74 STM32F072CBT6.20
LCD_CS2
  Bottom 0.254: LCD2.CS 26.33,22.35 14.48,22.35 12.96,23.87 STM32F072CBT6.19
LCD_DC  (via drill 0.6)
  Top 0.254: v16.76,25.91 26.33,25.91 LCD2.DC
  Bottom 0.254: LCD1.DC LCD2.DC | STM32F072CBT6.14 15.46,26.2 15.75,25.91 v16.76,25.91
LCD_RST  (via drill 0.6)
  Top 0.254: v17.02,27.69 20.57,27.69 20.83,27.94 LCD2.RES
  Bottom 0.254: LCD1.RES LCD2.RES | STM32F072CBT6.13 16.55,27.22 v17.02,27.69
N$1
  Bottom 0.254: STM32F072CBT6.44 13.96,39.19 R1.2
N$2
  Bottom 0.254: D1.8 1.14,21.38 R2.1
N$3
  Bottom 0.254: R5.1 LED1.A
N$4
  Bottom 0.254: D1.4 4.95,30.65 R3.1
N$5
  Bottom 0.254: D1.1 R4.1
N$6
  Bottom 0.254: R6.2 14.22,23.37 13.46,24.13 STM32F072CBT6.18
N$7
  Bottom 0.254: R6.1 LED2.A
N$8
  Bottom 0.254: STM32F072CBT6.5 19.18,32.12 U$36.P$2 23.9,34.28 C12.2
N$9
  Bottom 0.254: STM32F072CBT6.6 19.45,31.62 U$36.P$1 23.9,29.73 C13.1
N$10
  Bottom 0.406: ROT1.B R8.2 17.61,2.75 R10.2
N$11
  Bottom 0.406: ROT1.A 10.12,1.39 R7.2 11.34,2.49 R9.2
N$12
  Bottom 0.254: R14.2 48.22,1.52 | 48.22,1.52 R12.2 | 48.22,1.52 48.09,1.39 ROT4.B
N$13
  Bottom 0.254: ROT4.A R11.2
  Bottom 0.305: R13.2 39.41,1.48 R11.2
N$14
  Bottom 0.254: R18.2 R16.2 16.93,45.13 ROT2.B
N$15
  Bottom 0.254: ROT2.A 11.98,46.94 R15.2 R17.2
N$16
  Bottom 0.254: R22.2 R20.2 46.39,45.13 ROT3.B
N$17
  Bottom 0.254: ROT3.A 41.44,46.94 R19.2 R21.2
ROT1_A  (via drill 0.6)
  Top 0.254: v10.54,29.34 10.54,24.77 10.03,24.26 10.03,21.21 v8.51,19.68 | v8.26,4.57 8.64,4.95 10.92,4.95 11.94,5.97 v11.94,7.37
  Bottom 0.254: STM32F072CBT6.27 10.26,29.62 v10.54,29.34 | v8.51,19.68 8.51,15.37 11.94,11.94 v11.94,7.37 | C14.1 7.79,4.1 v8.26,4.57
  Bottom 0.406: R7.1 8.42,2.41 C14.1
ROT1_B  (via drill 0.6)
  Top 0.254: v10.54,18.03 10.54,24.13 11.68,25.27 v11.68,29.21 | v14.61,8.64 v18.67,4.57
  Bottom 0.254: STM32F072CBT6.28 11.41,30.12 11.68,29.84 v11.68,29.21 | v10.54,18.03 10.54,14.1 12.45,12.19 12.45,10.79 v14.61,8.64 | C15.1 21.17,3.6 20.19,4.57 v18.67,4.57
  Bottom 0.406: R8.1 20.66,2.79 C15.1
ROT1_SW  (via drill 0.6)
  Top 0.254: ROT1.S2 15.73,15.89 v11.43,20.19 | v6.86,24.77 v8.89,22.73
  Bottom 0.254: STM32F072CBT6.25 7.28,28.62 6.86,28.19 v6.86,24.77 | v8.89,22.73 v11.43,20.19
ROT2_A
  Bottom 0.254: STM32F072CBT6.40 11.96,42.91 10.41,44.45 10.41,46.9 R15.1 8.47,46.99 C18.1
ROT2_B
  Bottom 0.254: STM32F072CBT6.41 12.46,41.41 14.73,43.69 17.78,43.69 18.54,44.45 18.54,46.9 R16.1 20.49,46.99 C19.1
ROT2_SW  (via drill 0.6)
  Top 0.254: v10.92,42.67 10.16,43.43 10.16,49.02 17.02,55.88 17.02,59.54 ROT2.S2
  Bottom 0.254: STM32F072CBT6.39 11.46,42.14 v10.92,42.67
ROT3_A  (via drill 0.6)
  Top 0.254: v21.34,43.69 25.15,43.69 26.42,44.96 v35.23,44.96
  Bottom 0.254: v21.34,43.69 19.81,43.69 18.8,42.67 15.24,42.67 13.46,40.89 STM32F072CBT6.43 | v35.23,44.96 35.9,44.96 C20.1 39.7,46.9 R19.1
ROT3_B  (via drill 0.6)
  Top 0.254: v46.44,42.89 43.94,40.39 v21.59,40.39
  Bottom 0.254: v21.59,40.39 15.88,40.39 14.46,38.97 STM32F072CBT6.45 | v46.44,42.89 47.71,42.89 48.26,43.43 48.26,46.82 R20.1 48.18,46.9 C21.1
ROT3_SW  (via drill 0.6)
  Top 0.254: v20.07,44.7 25.15,44.7 36.83,56.39 43.25,56.39 ROT3.S2
  Bottom 0.254: v20.07,44.7 18.54,43.18 14.99,43.18 12.96,41.15 STM32F072CBT6.42
ROT4_A  (via drill 0.6)
  Top 0.254: v6.99,23.5 v8.89,21.59 | v17.27,9.4 17.27,7.11 18.03,6.35 19.18,6.35 24.13,1.4 v35.31,1.4
  Bottom 0.254: v8.89,21.59 17.27,13.21 v17.27,9.4 | STM32F072CBT6.26 7.02,29.12 6.35,28.45 6.35,25.53 6.1,25.27 6.1,24.38 v6.99,23.5 | 37.38,1.65 R11.1 v35.31,1.4
  Bottom 0.305: C16.1 37.55,1.48 R11.1
ROT4_B  (via drill 0.6)
  Top 0.254: v49.15,4.57 45.09,8.64 v44.96,8.64
  Bottom 0.254: v44.96,8.64 38.86,14.73 38.86,17.02 35.05,20.83 14.1,20.83 11.46,23.47 STM32F072CBT6.22 | v49.15,4.57 50.25,3.47 C17.1 50.13,3.17 R12.1
ROT4_SW
  Bottom 0.254: STM32F072CBT6.21 11.96,23.6 14.22,21.34 41,21.34 ROT4.S2
RST  (via drill 0.6)
  Top 0.254: v7.87,44.45 9.65,42.67 9.65,40.13 11.56,38.23 11.56,34.67 v12.45,33.78
  Bottom 0.254: TC1.10 7.11,48.51 7.11,45.21 v7.87,44.45 | STM32F072CBT6.7 16.51,31.12 16.26,31.37 15.88,31.75 13.84,33.78 v12.45,33.78
SPI1_CLK  (via drill 0.6)
  Top 0.254: LCD2.CLK 21.84,33.02 20.19,31.37 15.62,31.37 v14.99,30.73
  Bottom 0.254: LCD1.CLK LCD2.CLK | STM32F072CBT6.15 14.96,30.71 v14.99,30.73
SPI1_MOSI  (via drill 0.6)
  Top 0.254: v14.1,29.21 14.35,29.46 25.82,29.46 LCD2.MOSI
  Bottom 0.254: LCD1.MOSI LCD2.MOSI | STM32F072CBT6.17 13.96,29.07 v14.1,29.21
SWCLK
  Bottom 0.254: TC1.4 5.33,46.48 5.33,43.31 6.1,42.55 6.1,39.62 6.48,39.24 8.89,39.24 10.46,37.67 STM32F072CBT6.37
SWDIO
  Bottom 0.254: TC1.2 4.32,46.48 4.83,45.97 4.83,43.05 5.59,42.29 5.59,34.52 6.99,33.12 STM32F072CBT6.34

### Text on the board
tPlace: ab-berry v1.0 2016 / Designed by Eran Rundstein